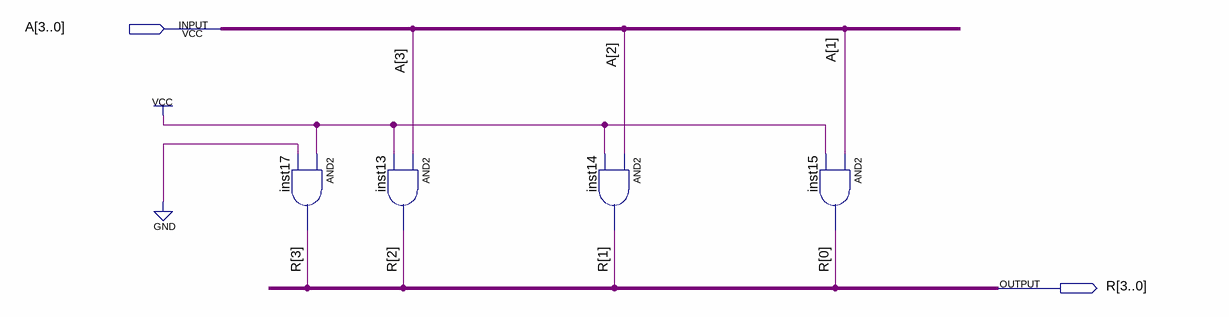
[diagram p0: schematic sheet]
// Quartus schematic shiftright.bdf as structural Verilog: 4 symbols, 2 pins
module shiftright (
  input  [3:0] A,
  output [3:0] R
);

  and inst17 (R[3], 1'b1, 1'b0);
  and inst13 (R[2], A[3], 1'b1);
  and inst14 (R[1], A[2], 1'b1);
  and inst15 (R[0], A[1], 1'b1);
endmodule
